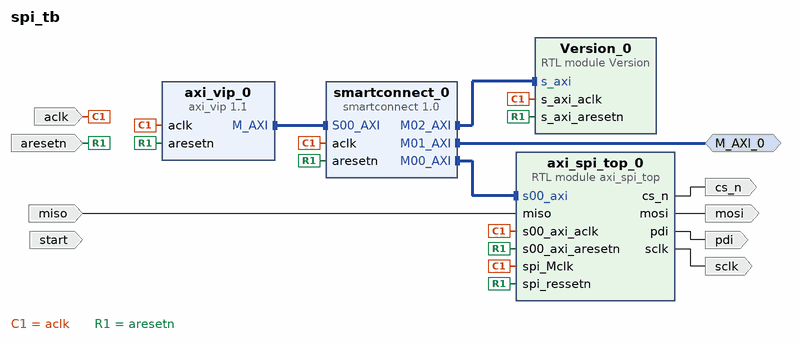
[diagram p0: block diagram of the top level]
# Vivado block design spi_tb, xck26-sfvc784-2LV-c, Vivado 2024.2
create_bd_design spi_tb

create_bd_intf_port -mode Master -vlnv xilinx.com:interface:aximm_rtl:1.0 M_AXI_0
set_property -dict {CONFIG.ADDR_WIDTH 32 CONFIG.DATA_WIDTH 32 CONFIG.PROTOCOL AXI4} [get_bd_intf_ports M_AXI_0]
create_bd_port -dir I -type clk aclk
set_property -dict {CONFIG.ASSOCIATED_BUSIF M_AXI_0} [get_bd_ports aclk]
create_bd_port -dir I -type rst aresetn
create_bd_port -dir O cs_n
create_bd_port -dir I miso
create_bd_port -dir O mosi
create_bd_port -dir O pdi
create_bd_port -dir O sclk
create_bd_port -dir I start

create_bd_cell -type ip -vlnv xilinx.com:ip:axi_vip:1.1 axi_vip_0
set_property -dict [list \
  CONFIG.ADDR_WIDTH 32 \
  CONFIG.ARUSER_WIDTH 0 \
  CONFIG.AWUSER_WIDTH 0 \
  CONFIG.BUSER_WIDTH 0 \
  CONFIG.DATA_WIDTH 32 \
  CONFIG.HAS_BRESP 1 \
  CONFIG.HAS_BURST 0 \
  CONFIG.HAS_CACHE 0 \
  CONFIG.HAS_PROT 1 \
  CONFIG.HAS_QOS 0 \
  CONFIG.HAS_REGION 0 \
  CONFIG.HAS_RRESP 0 \
  CONFIG.HAS_WSTRB 1 \
  CONFIG.ID_WIDTH 0 \
  CONFIG.INTERFACE_MODE MASTER \
  CONFIG.PROTOCOL AXI4 \
  CONFIG.READ_WRITE_MODE READ_WRITE \
  CONFIG.RUSER_WIDTH 0 \
  CONFIG.SUPPORTS_NARROW 0 \
  CONFIG.WUSER_WIDTH 0 \
] [get_bd_cells axi_vip_0]
create_bd_cell -type ip -vlnv xilinx.com:ip:smartconnect:1.0 smartconnect_0
set_property -dict {CONFIG.NUM_MI 3 CONFIG.NUM_SI 1} [get_bd_cells smartconnect_0]
create_bd_cell -type module -reference axi_spi_top axi_spi_top_0
create_bd_cell -type module -reference Version Version_0

# ---- connections ----

connect_bd_intf_net [get_bd_intf_pins axi_vip_0/M_AXI] [get_bd_intf_pins smartconnect_0/S00_AXI]
connect_bd_intf_net [get_bd_intf_pins axi_spi_top_0/s00_axi] [get_bd_intf_pins smartconnect_0/M00_AXI]
connect_bd_intf_net [get_bd_intf_ports M_AXI_0] [get_bd_intf_pins smartconnect_0/M01_AXI]
connect_bd_intf_net [get_bd_intf_pins Version_0/s_axi] [get_bd_intf_pins smartconnect_0/M02_AXI]
connect_bd_net -net aclk_0_1 [get_bd_ports aclk] \
  [get_bd_pins axi_vip_0/aclk] [get_bd_pins smartconnect_0/aclk] [get_bd_pins Version_0/s_axi_aclk] \
  [get_bd_pins axi_spi_top_0/s00_axi_aclk] [get_bd_pins axi_spi_top_0/spi_Mclk]
connect_bd_net -net aresetn_0_1 [get_bd_ports aresetn] \
  [get_bd_pins axi_vip_0/aresetn] [get_bd_pins smartconnect_0/aresetn] [get_bd_pins Version_0/s_axi_aresetn] \
  [get_bd_pins axi_spi_top_0/s00_axi_aresetn] [get_bd_pins axi_spi_top_0/spi_ressetn]
connect_bd_net [get_bd_pins axi_spi_top_0/cs_n] [get_bd_ports cs_n]
connect_bd_net [get_bd_pins axi_spi_top_0/mosi] [get_bd_ports mosi]
connect_bd_net [get_bd_pins axi_spi_top_0/pdi] [get_bd_ports pdi]
connect_bd_net [get_bd_pins axi_spi_top_0/sclk] [get_bd_ports sclk]
connect_bd_net [get_bd_ports miso] [get_bd_pins axi_spi_top_0/miso]
# net start_0_1 has one end: start

# ---- address map ----
assign_bd_address -offset 0x00000000 -range 16M -target_address_space [get_bd_addr_spaces axi_vip_0/Master_AXI] [get_bd_addr_segs axi_spi_top_0/s00_axi/reg0]
assign_bd_address -offset 0xA0000000 -range 4K -target_address_space [get_bd_addr_spaces axi_vip_0/Master_AXI] [get_bd_addr_segs Version_0/s_axi/reg0]
assign_bd_address -offset 0xA2000000 -range 64K -target_address_space [get_bd_addr_spaces axi_vip_0/Master_AXI] [get_bd_addr_segs M_AXI_0/Reg]

validate_bd_design
save_bd_design
